# Altium schematic sheet Ethernet.SchDoc
size A4
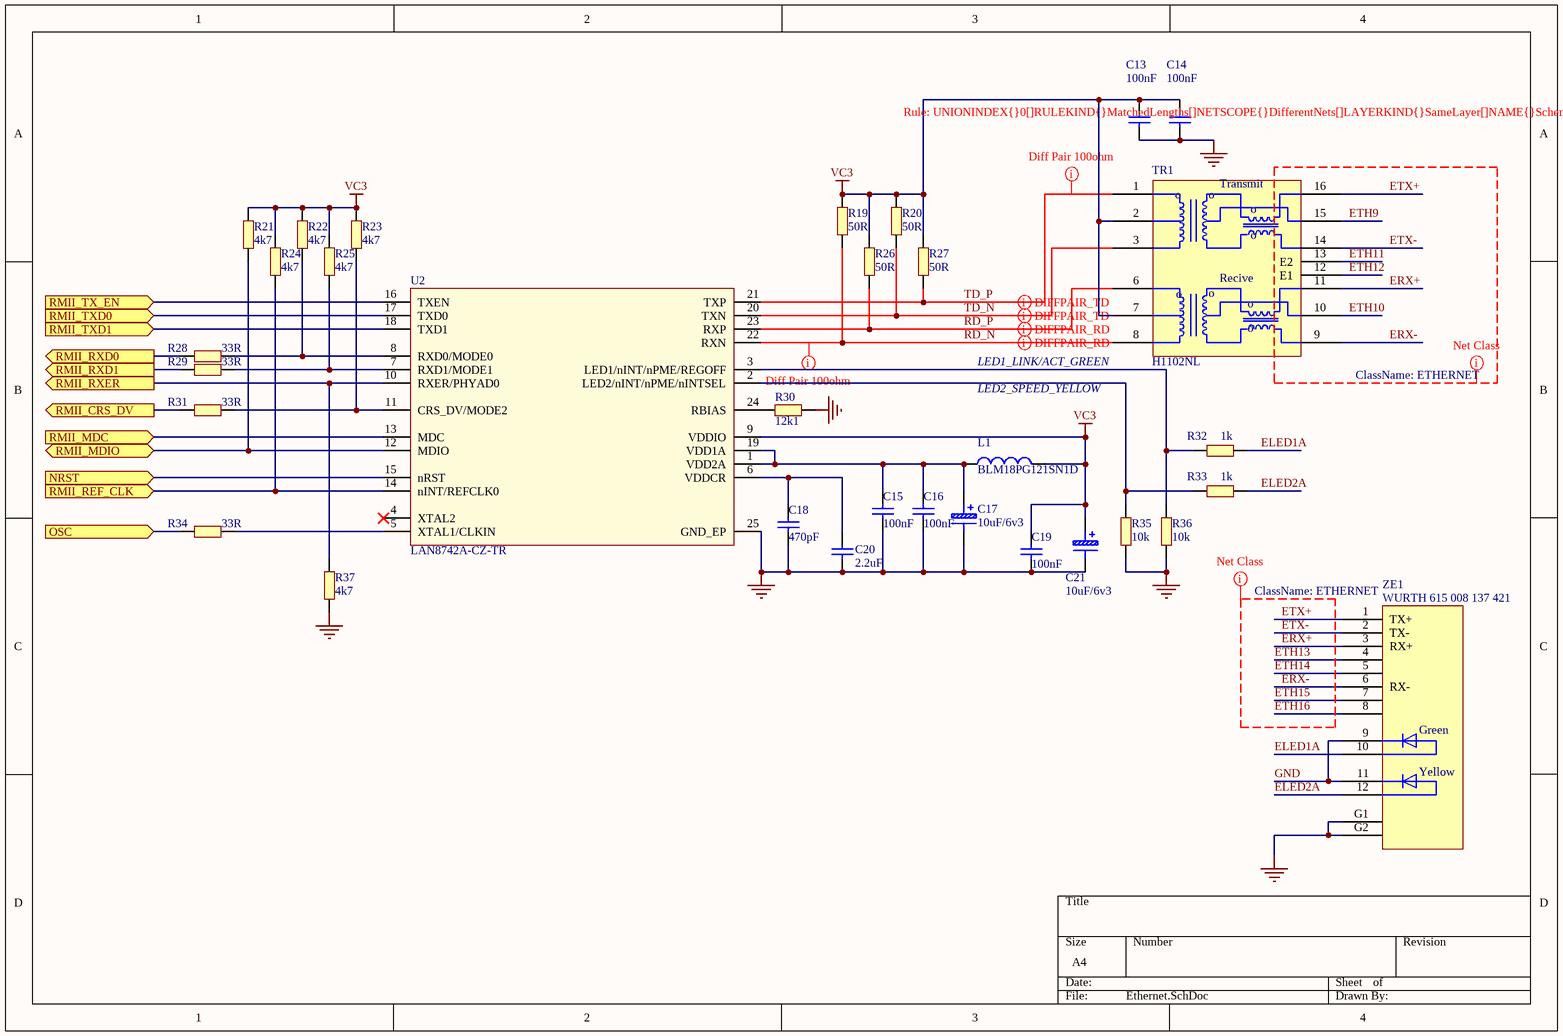
[diagram p0: Ethernet.SchDoc]

## Parts
C13  100nF  [0603C]
C14  100nF  [0603C]
C15  100nF  [0603C]
C16  100nF  [0603C]
C17  10uF/6v3  [CAP_A]
C18  470pF  [0603C]
C19  100nF  [0603C]
C20  2.2uF  [0603C]
C21  10uF/6v3  [CAP_A]
L1  BLM18PG121SN1D  [0603L]
R19  50R  [0603R]
R20  50R  [0603R]
R21  4k7  [0603R]
R22  4k7  [0603R]
R23  4k7  [0603R]
R24  4k7  [0603R]
R25  4k7  [0603R]
R26  50R  [0603R]
R27  50R  [0603R]
R28  33R  [0603R]
R29  33R  [0603R]
R30  12k1  [0603R]
R31  33R  [0603R]
R32  1k  [0603R]
R33  1k  [0603R]
R34  33R  [0603R]
R35  10k  [0603R]
R36  10k  [0603R]
R37  4k7  [0603R]
TR1  H1102NL  [H1102]
U2  LAN8742A-CZ-TR  [QFN24_LAN]
ZE1  WURTH 615 008 137 421  [RJ45GELED]

## Ports
NRST (in), OSC (in), RMII_CRS_DV (out), RMII_MDC (in), RMII_MDIO (bidir), RMII_REF_CLK (in), RMII_RXD0 (out), RMII_RXD1 (out), RMII_RXER (out), RMII_TX_EN (in), RMII_TXD0 (in), RMII_TXD1 (in)

## Nets
GND: C13.1 C14.1 C15.1 C16.1 C17.1 C18.1 C19.1 C20.1 C21.1 R30.1 R35.1 R36.1 R37.1 U2.25(GND_EP) ZE1.9 ZE1.11 ZE1.G1 ZE1.G2
VC3: C13.2 C14.2 C19.2 C21.2 L1.2 R19.2 R20.2 R21.2 R22.1 R23.1 R24.2 R25.1 R26.2 R27.2 TR1.2(TI2) TR1.7(RI2) U2.9(VDDIO)
ELED1A: R32.1 ZE1.10
ELED2A: R33.1 ZE1.12
ERX+: TR1.11(RO1) ZE1.3(RX+)
ERX-: TR1.9(RO2) ZE1.6(RX-)
ETH9: TR1.15
ETH10: TR1.10
ETH11: TR1.13(E2)
ETH12: TR1.12(E1)
ETH13: ZE1.4
ETH14: ZE1.5
ETH15: ZE1.7
ETH16: ZE1.8
ETX+: TR1.16(TO1) ZE1.1(TX+)
ETX-: TR1.14(TO2) ZE1.2(TX-)
NRST: U2.15(nRST) ; port NRST
OSC: R34.1 ; port OSC
RD_N: R19.1 TR1.8(RI3) U2.22(RXN)
RD_P: R26.1 TR1.6(RI1) U2.23(RXP)
RMII_CRS_DV: R31.1 ; port RMII_CRS_DV
RMII_MDC: U2.13(MDC) ; port RMII_MDC
RMII_MDIO: R21.1 U2.12(MDIO) ; port RMII_MDIO
RMII_REF_CLK: R24.1 U2.14(nINT/REFCLK0) ; port RMII_REF_CLK
RMII_RXD0: R28.1 ; port RMII_RXD0
RMII_RXD1: R29.1 ; port RMII_RXD1
RMII_RXER: R37.2 U2.10(RXER/PHYAD0) ; port RMII_RXER
RMII_TX_EN: U2.16(TXEN) ; port RMII_TX_EN
RMII_TXD0: U2.17(TXD0) ; port RMII_TXD0
RMII_TXD1: U2.18(TXD1) ; port RMII_TXD1
TD_N: R20.1 TR1.3(TI3) U2.20(TXN)
TD_P: R27.1 TR1.1(TI1) U2.21(TXP)
NetC15_2: C15.2 C16.2 C17.2 L1.1 U2.1(VDD2A) U2.19(VDD1A)
NetC18_2: C18.2 C20.2 U2.6(VDDCR)
NetR22_2: R22.2 R28.2 U2.8(RXD0/MODE0)
NetR23_2: R23.2 R31.2 U2.11(CRS_DV/MODE2)
NetR25_2: R25.2 R29.2 U2.7(RXD1/MODE1)
NetR30_2: R30.2 U2.24(RBIAS)
NetR32_2: R32.2 R36.2 U2.3(LED1/nINT/nPME/REGOFF)
NetR33_2: R33.2 R35.2 U2.2(LED2/nINT/nPME/nINTSEL)
NetR34_2: R34.2 U2.5(XTAL1/CLKIN)

Not connected (* = marked no-connect by the designer): U2 4(XTAL2)*

## Layout directives
differential pair: RD_N, RD_P, TD_N, TD_P
rule Matched Net Lengths [Tolerance = 300mil]: RD_N, TD_P
net class ETHERNET: ERX+, ERX-, ETH9, ETH10, ETH11, ETH12, ETH13, ETH14, ETH15, ETH16, ETX+, ETX-

## Notes on the sheet
- LED1_LINK/ACT_GREEN
- LED2_SPEED_YELLOW
- (in symbol H1102NL) Transmit; o; Recive
- (in symbol RJ45GELED) Green; Yellow

## Library data of the parts
C13-C16 C19 = Cap_100nF_X7R_10%_0402: Capacitor,100nF,16V,X7R,10%,0402,YAGEO; Manuf_Part_1: CC0402KRX7R7BB104; Revision: July-2002: Re-released for DXP Platform.; Value: 100nF; Order: CC0402KRX7R7BB104; Manuf_1: YAGEO
C17 C21 = CapTantal
C18 = Cap_470pF_X7R_10%_0402: Capacitor,470pF,16V,X7R,10%,0402,YAGEO; Manuf_Part_1: 0402YC471KAT4A; Revision: July-2002: Re-released for DXP Platform.; Value: 470pF; Order: 0402YC471KAT4A; Manuf_1: YAGEO; ECCN_US/EU: n/a
C20 = Cap_1uF_X5R_10%_0603: Capacitor,1uF,16V,X5R,10%,0603,YAGEO; Manuf_Part_1: CC0603KRX5R7BB105; Revision: July-2002: Re-released for DXP Platform.; Value: 1uF; Order: CC0603KRX5R7BB105; Manuf_1: YAGEO; ECCN_US/EU: n/a
L1 = BEAD_120R_2A_0603: Bead,120R,2A,0603,BLM18PG121SN1D,MURATA; Manuf_Part_3: FCM1608KF-601T03; Manuf_2: TDK; Manuf_Part_2: MPZ1608S300A; Manuf_3: Tai-tech; Value: 100uH; Description_3: Bead,600R,350mA,0603,FCM1608KF-601T03,Tai-tech; Description_2: Bead,30R,5A,0603,MPZ1608S300A,TDK; Revision: July-2002: Re-released for DXP Platform.; ECCN_US/EU: n/a; Manuf_Part_1: BLM18PG121SN1D; Manuf_1: MURATA
R19-R37 = RES3
TR1 = H1102NL: Dostawca.Symbol: 749010310; Dostawca: WURTH
U2 = LAN8742A-CZ-TR: LAN8742A-CZ-TR - Small Footprint RMII 10/100 Ethernet, Transceiver with HP Auto-MDIX and flexPWR Technology SQFN-24; Manuf_1: MICROCHIP; Dostawca.Symbol: 579-LAN8742A-CZ; Dostawca: Mouser; Order: LAN8742A-CZ-TR; Manuf_Part_1: LAN8742A-CZ-TR; Distrib: MICROCHIP
ZE1 = RJ45GELED